# Altium schematic sheet PWR_mosfet.SchDoc
size A2
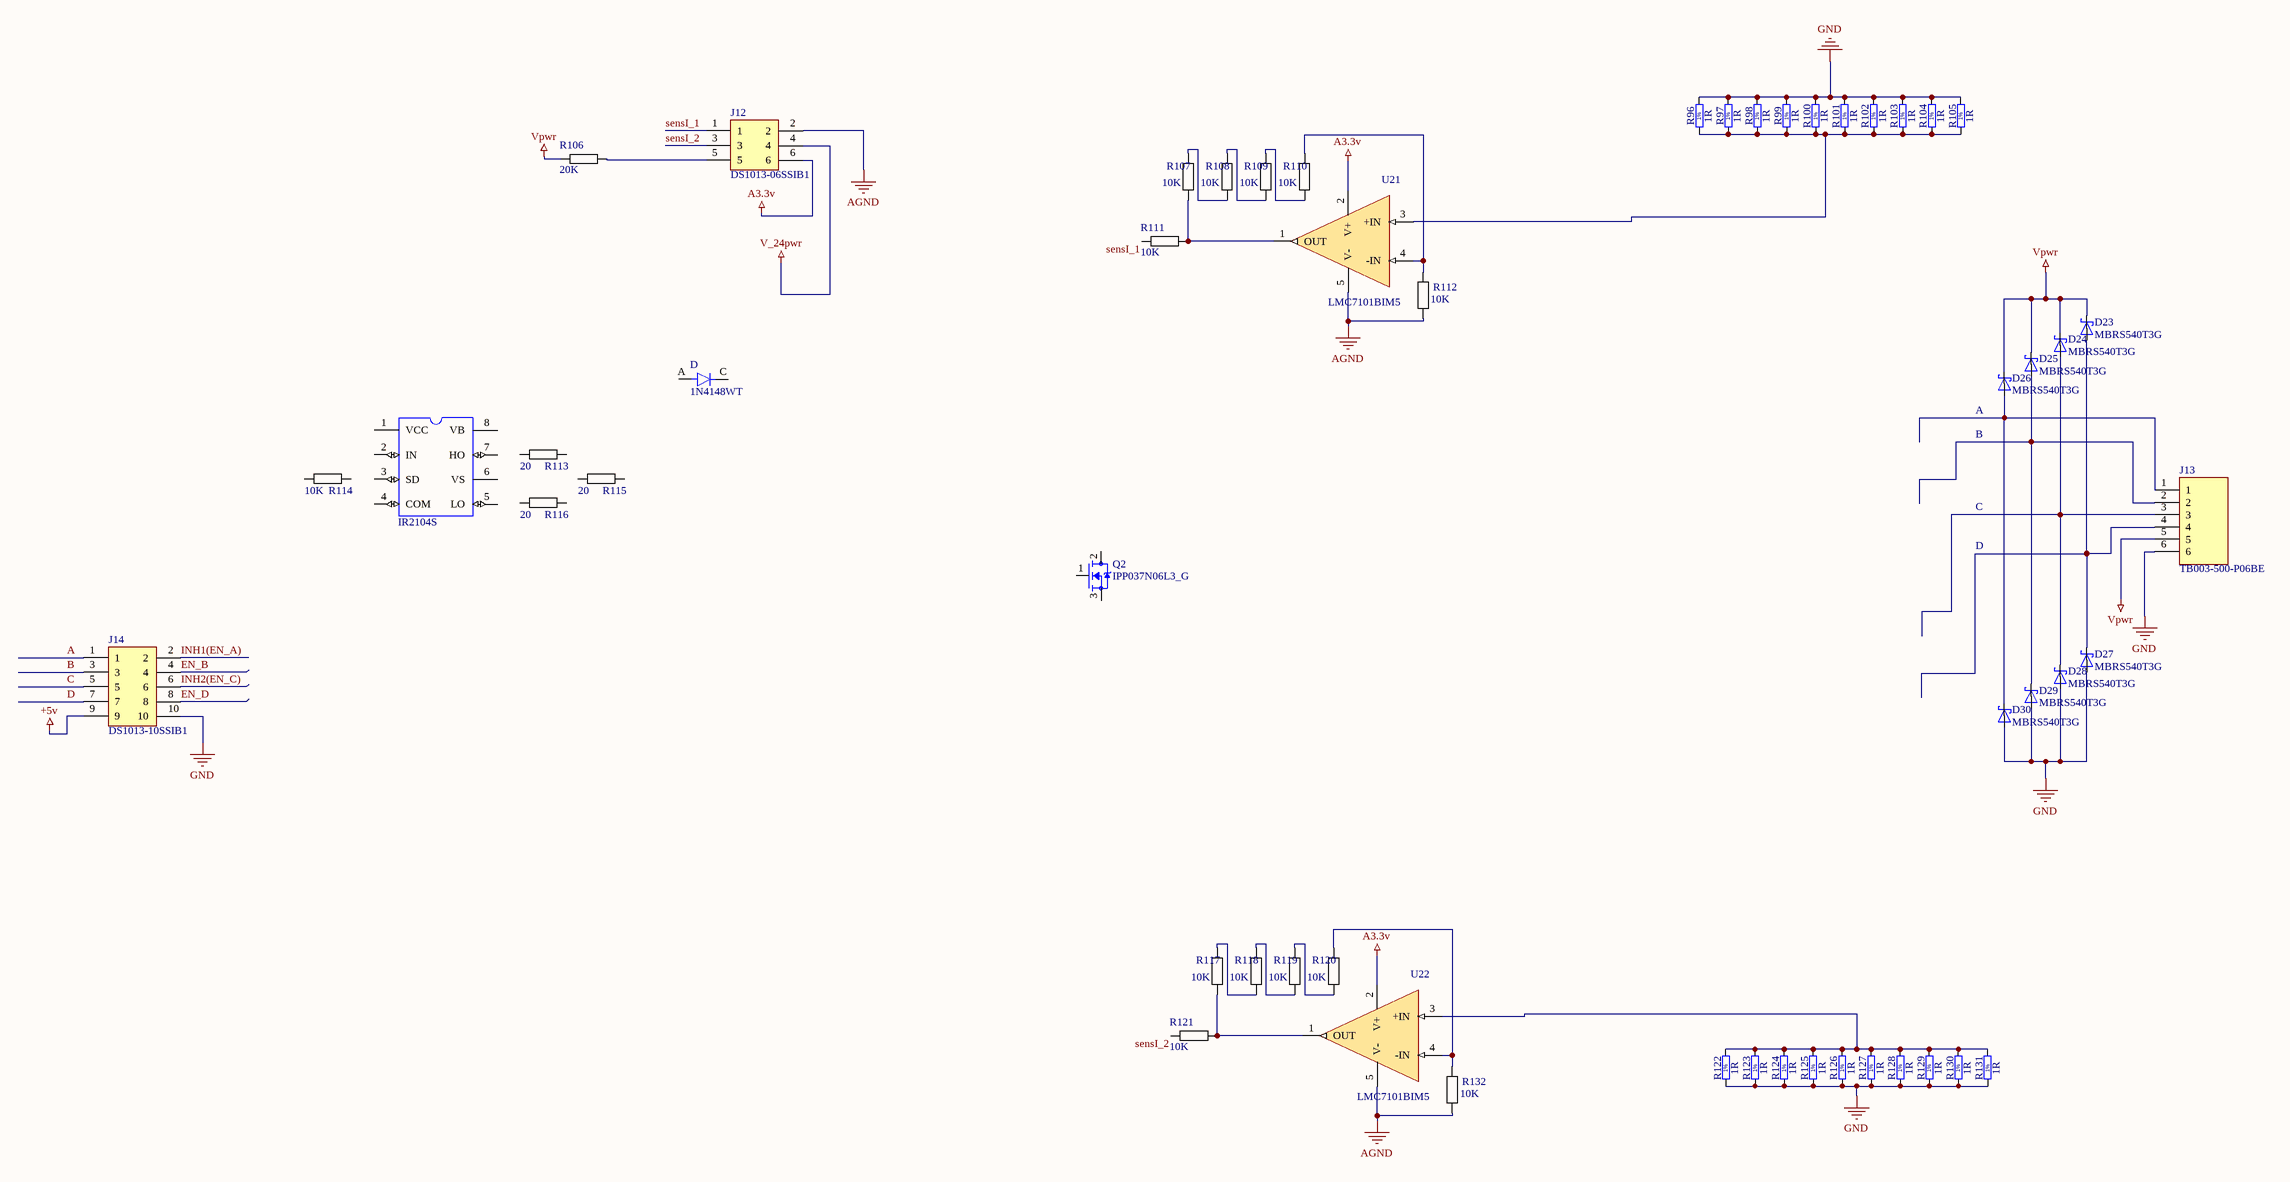
[diagram p0: PWR_mosfet.SchDoc]

## Parts
?  IR2104S  [IR2104S]
D  1N4148WT  [SODFL1608X70N]
D23  MBRS540T3G  [DIOM7958X213N]
D24  MBRS540T3G  [DIOM7958X213N]
D25  MBRS540T3G  [DIOM7958X213N]
D26  MBRS540T3G  [DIOM7958X213N]
D27  MBRS540T3G  [DIOM7958X213N]
D28  MBRS540T3G  [DIOM7958X213N]
D29  MBRS540T3G  [DIOM7958X213N]
D30  MBRS540T3G  [DIOM7958X213N]
J12  DS1013-06SSIB1  [CONNFLY_DS1013-06SSIB1]
J13  TB003-500-P06BE  [CUI_TB003-500-P06BE]
J14  DS1013-10SSIB1  [CONNFLY_DS1013-10SSIB1]
Q2  IPP037N06L3_G  [TO-220-KCS0003B]
R96  1R  [R2512]
R97  1R  [R2512]
R98  1R  [R2512]
R99  1R  [R2512]
R100  1R  [R2512]
R101  1R  [R2512]
R102  1R  [R2512]
R103  1R  [R2512]
R104  1R  [R2512]
R105  1R  [R2512]
R106  20K  [Resistor 0805]
R107  10K  [Resistor 0805]
R108  10K  [Resistor 0805]
R109  10K  [Resistor 0805]
R110  10K  [Resistor 0805]
R111  10K  [Resistor 0805]
R112  10K  [Resistor 0805]
R113  20  [Resistor 0805]
R114  10K  [Resistor 0805]
R115  20  [Resistor 0805]
R116  20  [Resistor 0805]
R117  10K  [Resistor 0805]
R118  10K  [Resistor 0805]
R119  10K  [Resistor 0805]
R120  10K  [Resistor 0805]
R121  10K  [Resistor 0805]
R122  1R  [R2512]
R123  1R  [R2512]
R124  1R  [R2512]
R125  1R  [R2512]
R126  1R  [R2512]
R127  1R  [R2512]
R128  1R  [R2512]
R129  1R  [R2512]
R130  1R  [R2512]
R131  1R  [R2512]
R132  10K  [Resistor 0805]
U21  LMC7101BIM5  [*SOT95P280X145-5N]
U22  LMC7101BIM5  [*SOT95P280X145-5N]

## Nets
+5v: J14.9
A3.3v: J12.6 U21.2(V+) U22.2(V+)
AGND: J12.2 R112.1 R132.1 U21.5(V-) U22.5(V-)
GND: D27.A D28.A D29.A D30.A J13.6 J14.10 R96.2 R97.2 R98.2 R99.2 R100.2 R101.2 R102.2 R103.2 R104.2 R105.2 R122.1 R123.1 R124.1 R125.1 R126.1 R127.1 R128.1 R129.1 R130.1 R131.1
V_24pwr: J12.4
Vpwr: D23.C D24.C D25.C D26.C J13.5 R106.1
A: J14.1
B: J14.3
C: J14.5
D: J14.7
EN_B: J14.4
EN_D: J14.8
INH1(EN_A): J14.2
INH2(EN_C): J14.6
sensI_1: J12.1 R111.1
sensI_2: J12.3 R121.1
NetD23_A: D23.A D27.C J13.4
NetD24_A: D24.A D28.C J13.3
NetD25_A: D25.A D29.C J13.2
NetD26_A: D26.A D30.C J13.1
NetJ12_5: J12.5 R106.2
NetR96_1: R96.1 R97.1 R98.1 R99.1 R100.1 R101.1 R102.1 R103.1 R104.1 R105.1 U21.3(+IN)
NetR107_1: R107.1 R108.2
NetR107_2: R107.2 R111.2 U21.1(OUT)
NetR108_1: R108.1 R109.2
NetR109_1: R109.1 R110.2
NetR110_1: R110.1 R112.2 U21.4(-IN)
NetR117_1: R117.1 R118.2
NetR117_2: R117.2 R121.2 U22.1(OUT)
NetR118_1: R118.1 R119.2
NetR119_1: R119.1 R120.2
NetR120_1: R120.1 R132.2 U22.4(-IN)
NetR122_2: R122.2 R123.2 R124.2 R125.2 R126.2 R127.2 R128.2 R129.2 R130.2 R131.2 U22.3(+IN)

Not connected (* = marked no-connect by the designer): ? 1(VCC) 2(IN) 3(SD) 4(COM) 5(LO) 6(VS) 7(HO) 8(VB); D A C; Q2 1(G) 2(D) 3(S); R113 1 2; R114 1 2; R115 1 2; R116 1 2

## Notes on the sheet
- (near D26) A
- B
- C
- D
- (in symbol Resistor - 1%) 1%

## Library data of the parts
? = IR2104S: Half-Bridge Gate Driver IC Non-Inverting 8-SOIC; MF: Infineon Technologies; SnapEDA_Link: https://www.snapeda.com/parts/IR2104S/Infineon%20Technologies/view-part/582439/?ref=snap; Package: SO-8 Infineon; MP: IR2104S; Price: None; Value: *; Availability: Unavailable
D = 1N4148WT: Diode Standard 100V 150mA Surface Mount SOD-123; MP: 1N4148W+; MF: Micro Commercial; Package: SOD-123 Multicomp; Value: *; Availability: Unavailable; Price: None; SnapEDA_Link: https://www.snapeda.com/parts/1N4148W%2B/Micro%20Commercial/view-part/2755184/?ref=snap
D23-D30 = MBRS540T3G: Diode Schottky 40V 5A Surface Mount SMC; MF: ON Semiconductor; SnapEDA_Link: https://www.snapeda.com/parts/MBRS540T3G/ON%20Semiconductor/view-part/78777/?ref=snap; MP: MBRS540T3G; Availability: Unavailable; Price: None; Value: *; Package: DO-214 ON Semiconductor
J12 = DS1013-06SSIB1: Socket; IDC; male; PIN: 6; straight; THT; gold plated; 2.54mm
J13 = TB003-500-P06BE: 2~24 Poles, Screw Type, Horizontal, 5.0 Pitch, 26~14 _AWG_, Terminal Block Connector; MF: CUI Devices; Value: *; Price: None; MP: TB003-500-P06BE; SnapEDA_Link: https://www.snapeda.com/parts/TB003-500-P06BE/CUI%20Devices/view-part/3590657/?ref=snap; Package: None; Availability: Unavailable
J14 = DS1013-10SSIB1: Socket; IDC; male; PIN: 10; straight; THT; gold plated; 2.54mm; MF: Connfly; Availability: Unavailable; Price: None; Package: None; Value: *; SnapEDA_Link: https://www.snapeda.com/parts/DS1013-10SSIB1/Connfly/view-part/951223/?ref=snap; MP: DS1013-10SSIB1; BuyPart: https://www.snapeda.com/parts/DS1013-10SSIB1/Connfly/view-part/951223/?ref=eda
Q2 = IPP037N06L3_G: N-Channel 60 V 90 A 3.4 mO 59 nC OptiMOS 3 Power Transistor - TO-220; Package: None; Price: None; Value: *; MP: IPP037N06L3_G; Availability: Unavailable
R96-R105 R122-R131 = Resistor - 1%
R106-R121 R132 = Resistor: Value: *
U21 U22 = LMC7101BIM5: Check_prices: https://www.snapeda.com/parts/LMC7101BIM5/Texas%20Instruments/view-part/19255/?ref=eda; SnapEDA_Link: https://www.snapeda.com/parts/LMC7101BIM5/Texas%20Instruments/view-part/19255/?ref=snap; Value: *